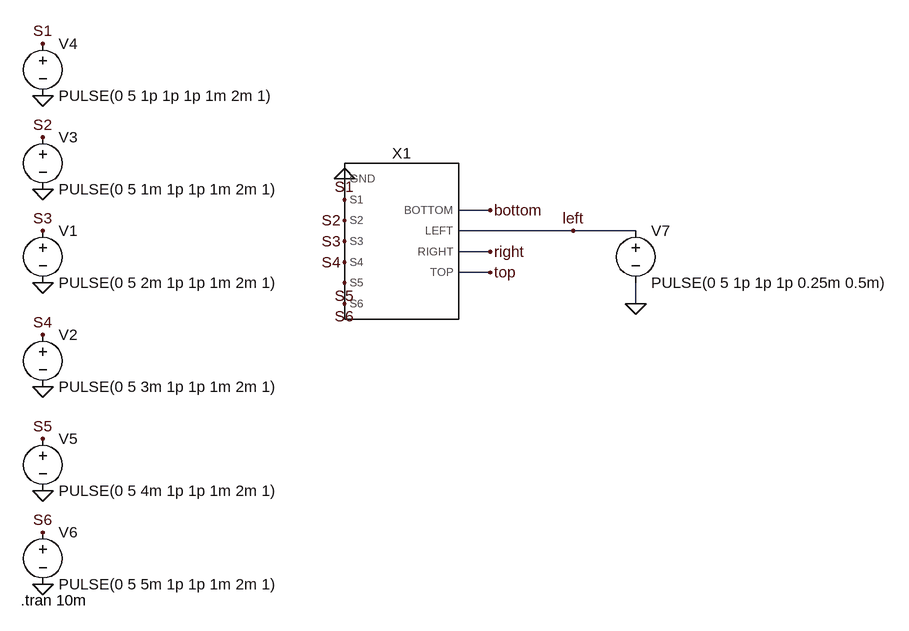
[diagram p0: schematic nmos_switch_test.asc]
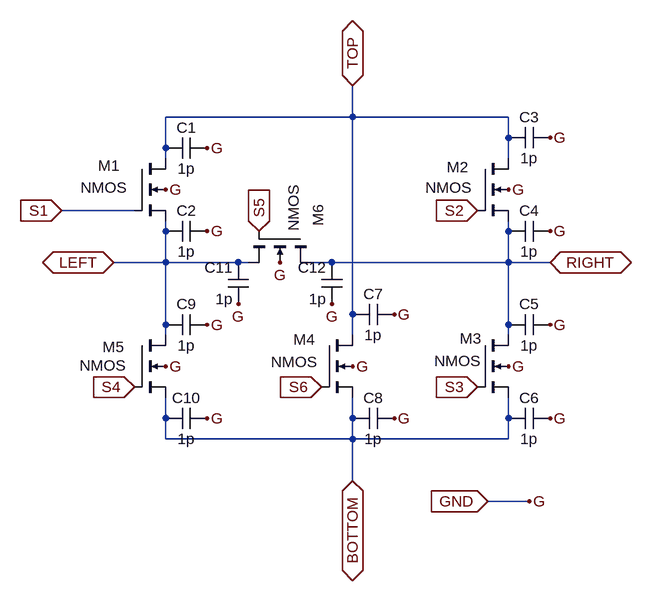
[diagram p1: sub-circuit nmos_switch.asc]
nmos_switch_test.asc, the LTspice schematic file:
Version 4
SHEET 1 1020 788
WIRE 384 144 336 144
WIRE 512 176 336 176
WIRE 608 176 512 176
WIRE 384 208 336 208
WIRE 384 240 336 240
WIRE 608 288 608 256
FLAG 160 96 0
FLAG -304 176 S3
FLAG 160 128 S1
FLAG -304 256 0
FLAG -304 32 S2
FLAG -304 112 0
FLAG -304 -112 S1
FLAG -304 -32 0
FLAG 160 160 S2
FLAG 160 192 S3
FLAG 160 224 S4
FLAG 160 256 S5
FLAG 160 288 S6
FLAG -304 336 S4
FLAG -304 416 0
FLAG -304 496 S5
FLAG -304 576 0
FLAG -304 640 S6
FLAG -304 720 0
FLAG 608 288 0
FLAG 512 176 left
FLAG 384 144 bottom
FLAG 384 208 right
FLAG 384 240 top
SYMBOL nmos_switch 240 192 R0
SYMATTR InstName X1
SYMBOL voltage -304 160 R0
WINDOW 123 0 0 Left 0
WINDOW 39 0 0 Left 0
SYMATTR InstName V1
SYMATTR Value PULSE(0 5 2m 1p 1p 1m 2m 1)
SYMBOL voltage -304 16 R0
WINDOW 123 0 0 Left 0
WINDOW 39 0 0 Left 0
SYMATTR InstName V3
SYMATTR Value PULSE(0 5 1m 1p 1p 1m 2m 1)
SYMBOL voltage -304 -128 R0
WINDOW 123 0 0 Left 0
WINDOW 39 0 0 Left 0
SYMATTR InstName V4
SYMATTR Value PULSE(0 5 1p 1p 1p 1m 2m 1)
SYMBOL voltage -304 320 R0
WINDOW 123 0 0 Left 0
WINDOW 39 0 0 Left 0
SYMATTR InstName V2
SYMATTR Value PULSE(0 5 3m 1p 1p 1m 2m 1)
SYMBOL voltage -304 480 R0
WINDOW 123 0 0 Left 0
WINDOW 39 0 0 Left 0
SYMATTR InstName V5
SYMATTR Value PULSE(0 5 4m 1p 1p 1m 2m 1)
SYMBOL voltage -304 624 R0
WINDOW 123 0 0 Left 0
WINDOW 39 0 0 Left 0
SYMATTR InstName V6
SYMATTR Value PULSE(0 5 5m 1p 1p 1m 2m 1)
SYMBOL voltage 608 160 R0
WINDOW 123 0 0 Left 0
WINDOW 39 0 0 Left 0
SYMATTR InstName V7
SYMATTR Value PULSE(0 5 1p 1p 1p 0.25m 0.5m)
TEXT -338 744 Left 2 !.tran 10m

nmos_switch.asc, the sub-circuit schematic file:
Version 4
SHEET 1 1064 680
WIRE 624 -160 624 -208
WIRE 624 -160 336 -160
WIRE 864 -160 624 -160
WIRE 864 -128 864 -160
WIRE 336 -112 336 -160
WIRE 336 -96 336 -112
WIRE 864 -96 864 -128
WIRE 288 -16 176 -16
WIRE 336 16 336 0
WIRE 864 16 864 0
WIRE 336 64 336 16
WIRE 336 64 256 64
WIRE 448 64 336 64
WIRE 464 64 448 64
WIRE 592 64 560 64
WIRE 864 64 864 16
WIRE 864 64 592 64
WIRE 928 64 864 64
WIRE 624 144 624 -160
WIRE 336 160 336 64
WIRE 864 160 864 64
WIRE 336 176 336 160
WIRE 624 176 624 144
WIRE 864 176 864 160
WIRE 336 304 336 272
WIRE 624 304 624 272
WIRE 864 304 864 272
WIRE 336 336 336 304
WIRE 624 336 624 304
WIRE 624 336 336 336
WIRE 864 336 864 304
WIRE 864 336 624 336
WIRE 624 400 624 336
WIRE 896 432 832 432
FLAG 624 -208 TOP
IOPIN 624 -208 BiDir
FLAG 624 400 BOTTOM
IOPIN 624 400 BiDir
FLAG 256 64 LEFT
IOPIN 256 64 BiDir
FLAG 928 64 RIGHT
IOPIN 928 64 BiDir
FLAG 832 432 GND
IOPIN 832 432 In
FLAG 896 432 G
FLAG 336 -48 G
FLAG 400 -112 G
FLAG 400 16 G
FLAG 512 64 G
FLAG 448 128 G
FLAG 592 128 G
FLAG 688 144 G
FLAG 624 224 G
FLAG 688 304 G
FLAG 400 160 G
FLAG 336 224 G
FLAG 400 304 G
FLAG 928 304 G
FLAG 864 224 G
FLAG 928 160 G
FLAG 928 16 G
FLAG 864 -48 G
FLAG 928 -128 G
FLAG 176 -16 S1
IOPIN 176 -16 In
FLAG 816 -16 S2
IOPIN 816 -16 In
FLAG 816 256 S3
IOPIN 816 256 In
FLAG 288 256 S4
IOPIN 288 256 In
FLAG 480 16 S5
IOPIN 480 16 In
FLAG 576 256 S6
IOPIN 576 256 In
SYMBOL nmos4 288 -96 R0
WINDOW 0 -56 11 Left 2
WINDOW 3 -83 45 Left 2
SYMATTR InstName M1
SYMBOL nmos4 816 -96 R0
WINDOW 0 -47 13 Left 2
WINDOW 3 -80 45 Left 2
SYMATTR InstName M2
SYMBOL nmos4 816 176 R0
WINDOW 0 -27 5 Left 2
WINDOW 3 -66 40 Left 2
SYMATTR InstName M3
SYMBOL nmos4 576 176 R0
WINDOW 0 -43 7 Left 2
WINDOW 3 -78 41 Left 2
SYMATTR InstName M4
SYMBOL nmos4 288 176 R0
WINDOW 0 -49 18 Left 2
WINDOW 3 -84 47 Left 2
SYMATTR InstName M5
SYMBOL nmos4 560 16 R90
WINDOW 0 -41 -11 Left 2
WINDOW 3 -72 27 Left 2
SYMATTR InstName M6
SYMBOL cap 400 -128 R90
WINDOW 0 0 32 VBottom 2
WINDOW 3 32 32 VTop 2
SYMATTR InstName C1
SYMATTR Value 1p
SYMBOL cap 400 0 R90
WINDOW 0 0 32 VBottom 2
WINDOW 3 32 32 VTop 2
SYMATTR InstName C2
SYMATTR Value 1p
SYMBOL cap 928 -144 R90
WINDOW 0 0 32 VBottom 2
WINDOW 3 32 32 VTop 2
SYMATTR InstName C3
SYMATTR Value 1p
SYMBOL cap 928 0 R90
WINDOW 0 0 32 VBottom 2
WINDOW 3 32 32 VTop 2
SYMATTR InstName C4
SYMATTR Value 1p
SYMBOL cap 928 144 R90
WINDOW 0 0 32 VBottom 2
WINDOW 3 32 32 VTop 2
SYMATTR InstName C5
SYMATTR Value 1p
SYMBOL cap 928 288 R90
WINDOW 0 0 32 VBottom 2
WINDOW 3 32 32 VTop 2
SYMATTR InstName C6
SYMATTR Value 1p
SYMBOL cap 688 128 R90
WINDOW 0 0 32 VBottom 2
WINDOW 3 32 32 VTop 2
SYMATTR InstName C7
SYMATTR Value 1p
SYMBOL cap 688 288 R90
WINDOW 0 0 32 VBottom 2
WINDOW 3 32 32 VTop 2
SYMATTR InstName C8
SYMATTR Value 1p
SYMBOL cap 400 144 R90
WINDOW 0 0 32 VBottom 2
WINDOW 3 32 32 VTop 2
SYMATTR InstName C9
SYMATTR Value 1p
SYMBOL cap 400 288 R90
WINDOW 0 0 32 VBottom 2
WINDOW 3 32 32 VTop 2
SYMATTR InstName C10
SYMATTR Value 1p
SYMBOL cap 464 128 R180
WINDOW 0 24 56 Left 2
WINDOW 3 24 8 Left 2
SYMATTR InstName C11
SYMATTR Value 1p
SYMBOL cap 608 128 R180
WINDOW 0 24 56 Left 2
WINDOW 3 24 8 Left 2
SYMATTR InstName C12
SYMATTR Value 1p

The netlist it stands for:
* nmos_switch_test.asc
XX1 0 S1 S2 S3 S4 S5 S6 bottom left right top nmos_switch
V1 S3 0 PULSE(0 5 2m 1p 1p 1m 2m 1)
V3 S2 0 PULSE(0 5 1m 1p 1p 1m 2m 1)
V4 S1 0 PULSE(0 5 1p 1p 1p 1m 2m 1)
V2 S4 0 PULSE(0 5 3m 1p 1p 1m 2m 1)
V5 S5 0 PULSE(0 5 4m 1p 1p 1m 2m 1)
V6 S6 0 PULSE(0 5 5m 1p 1p 1m 2m 1)
V7 left 0 PULSE(0 5 1p 1p 1p 0.25m 0.5m)

* block symbol definitions
.subckt nmos_switch GND S1 S2 S3 S4 S5 S6 BOTTOM LEFT RIGHT TOP
M1 TOP S1 LEFT GND NMOS
M2 TOP S2 RIGHT GND NMOS
M3 RIGHT S3 BOTTOM GND NMOS
M4 TOP S6 BOTTOM GND NMOS
M5 LEFT S4 BOTTOM GND NMOS
M6 RIGHT S5 LEFT GND NMOS
C1 GND TOP 1p
C2 GND LEFT 1p
C3 GND TOP 1p
C4 GND RIGHT 1p
C5 GND RIGHT 1p
C6 GND BOTTOM 1p
C7 GND TOP 1p
C8 GND BOTTOM 1p
C9 GND LEFT 1p
C10 GND BOTTOM 1p
C11 GND LEFT 1p
C12 GND RIGHT 1p
.ends nmos_switch

.model NMOS NMOS
.model PMOS PMOS
.lib standard.mos
.tran 10m
.backanno
.end